# EAGLE design KENDALI POMPA TANK (EAGLE 7.4.0)
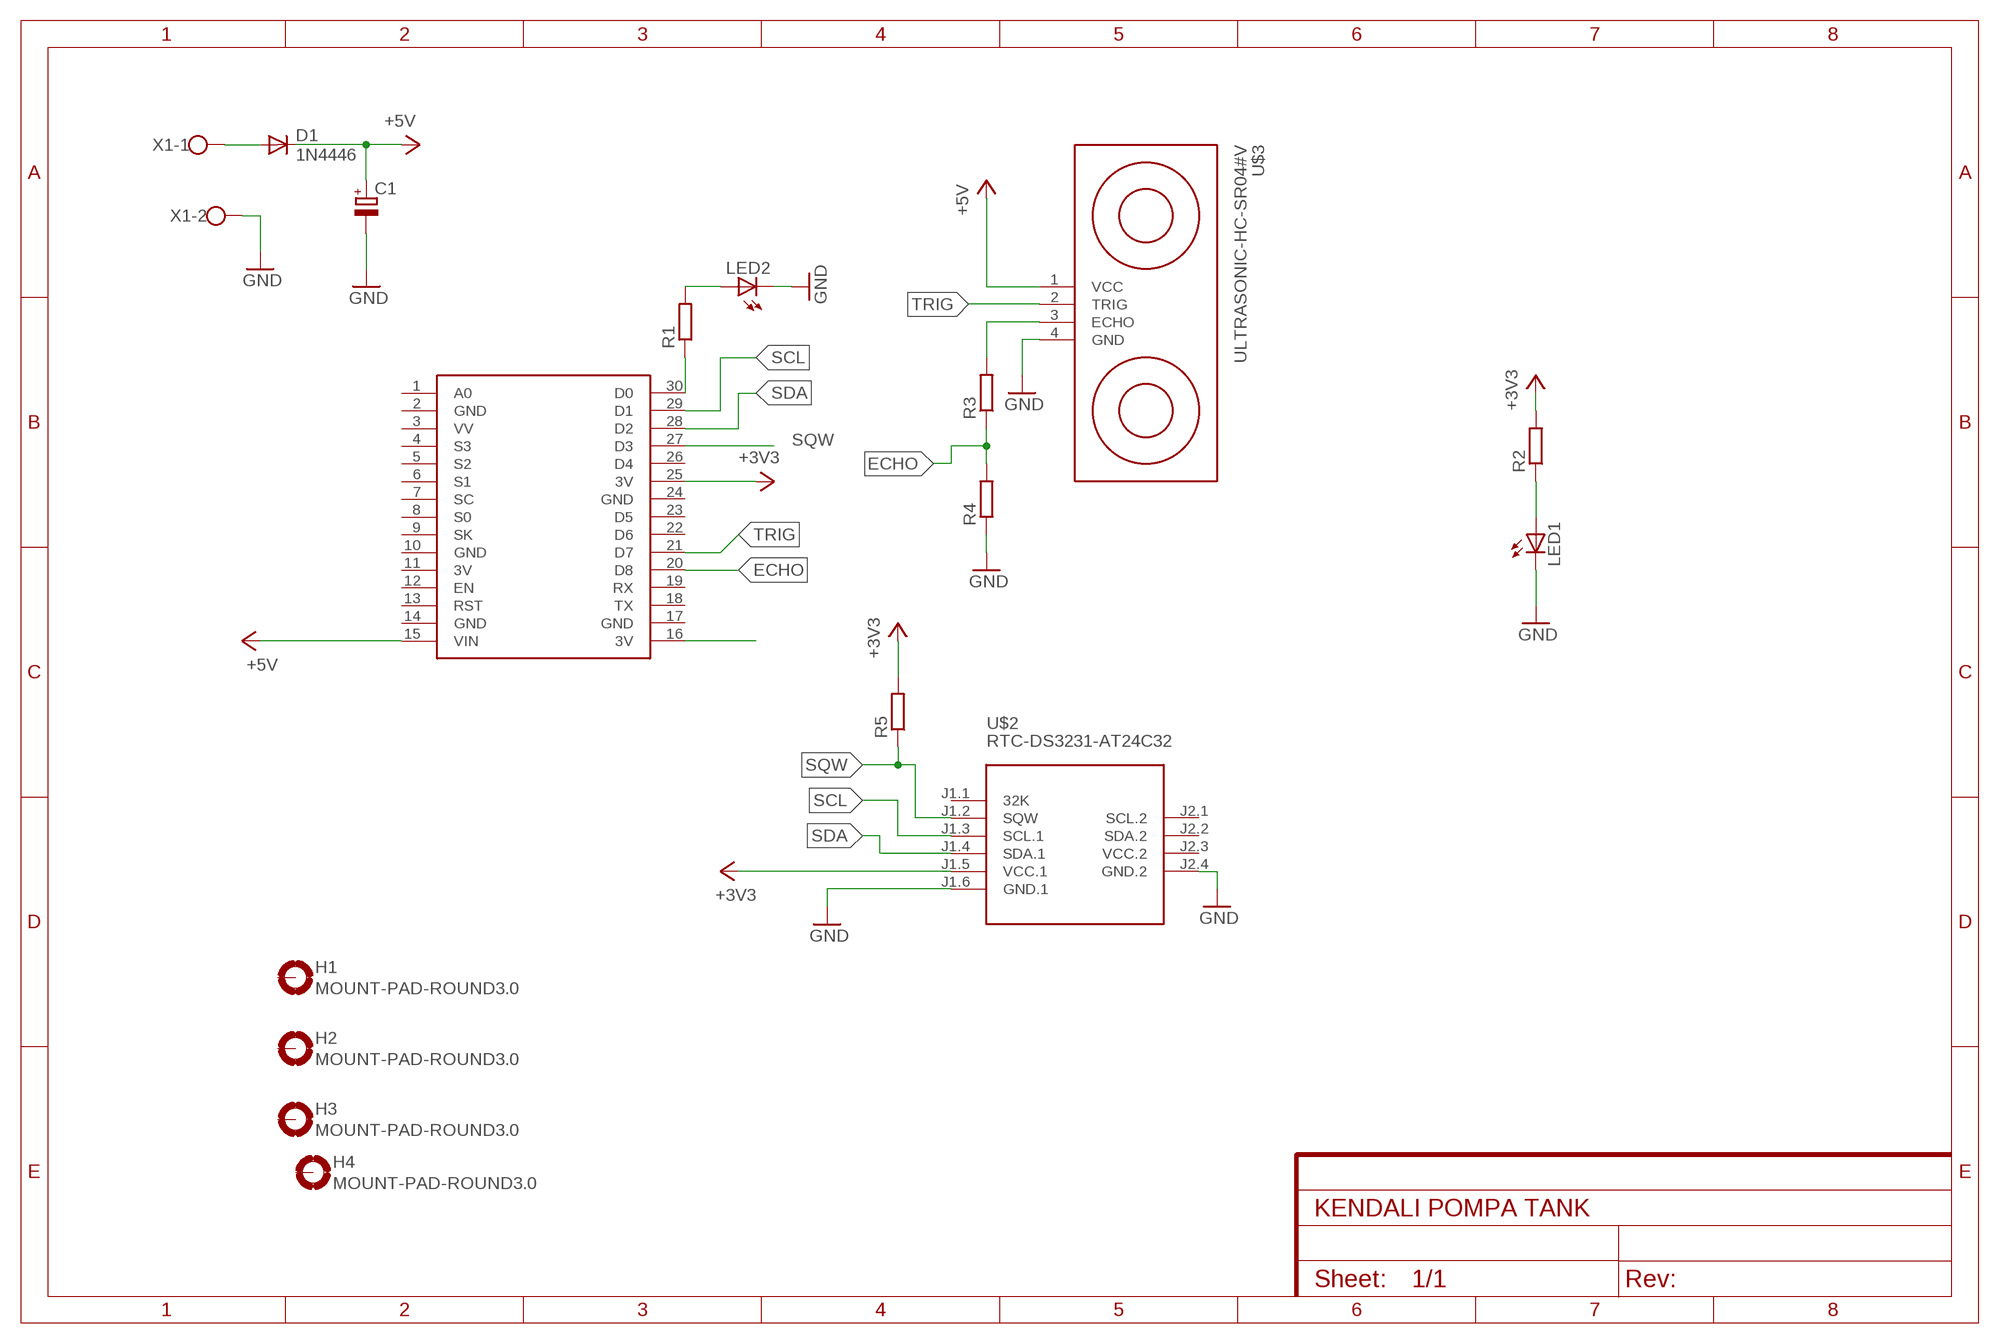
[diagram p0: schematic, sheet 1]

## Parts
C1  CPOL-EUE5-5  [E5-5]
D1  1N4446  [DO35-10]
H1  MOUNT-PAD-ROUND3.0  [3,0-PAD]
H2  MOUNT-PAD-ROUND3.0  [3,0-PAD]
H3  MOUNT-PAD-ROUND3.0  [3,0-PAD]
H4  MOUNT-PAD-ROUND3.0  [3,0-PAD]
LED1  LED5MM  [LED5MM]
LED2  LED5MM  [LED5MM]
R1  R-EU_0207/10  [0207/10]
R2  R-EU_0207/10  [0207/10]
R3  R-EU_0207/10  [0207/10]
R4  R-EU_0207/10  [0207/10]
R5  R-EU_0207/10  [0207/10]
U$1  NODEMCU  [NODEMCU]
U$2  RTC-DS3231-AT24C32  [RTC-DS3231-AT24C32]
U$3  ULTRASONIC-HC-SR04#V  [ULTRASONIC-HC-SR04#V]
X1  W237-102  [W237-102]

## Nets
+3V3: R2.2 R5.2 U$1.25(3V) U$2.J1.5(VCC.1)
+5V: C1.+ D1.C U$1.15(VIN) U$3.1(VCC)
ECHO: R3.1 R4.2 U$1.20(D8)
GND: C1.- LED1.K(C) LED2.K(C) R4.1 U$2.J1.6(GND.1) U$2.J2.4(GND.2) U$3.4(GND) X1.2
N$1: U$1.16(3V)
N$2: R1.1 U$1.30(D0)
N$3: LED2.A R1.2
N$4: LED1.A R2.1
N$5: D1.A X1.1
N$6: R3.2 U$3.3(ECHO)
SCL: U$1.29(D1) U$2.J1.3(SCL.1)
SDA: U$1.28(D2) U$2.J1.4(SDA.1)
SQW: R5.1 U$1.27(D3) U$2.J1.2(SQW)
TRIG: U$1.21(D7) U$3.2(TRIG)
Unconnected: H1.B3,0(MOUNT) H2.B3,0(MOUNT) H3.B3,0(MOUNT) H4.B3,0(MOUNT) U$1.1(A0) U$1.3(VV) U$1.4(S3) U$1.5(S2) U$1.6(S1) U$1.7(SC) U$1.8(S0) U$1.9(SK) U$1.12(EN) U$1.13(RST) U$1.18(TX) U$1.19(RX) U$1.22(D6) U$1.23(D5) U$1.26(D4) U$2.J1.1(32K) U$2.J2.1(SCL.2) U$2.J2.2(SDA.2)

## Power pins joined to a net without a drawn wire
3V: U$1.11(3V)
GND: U$1.2(GND) U$1.10(GND) U$1.14(GND) U$1.17(GND) U$1.24(GND)
VCC.2: U$2.J2.3(VCC.2)

## Library data of the parts
C1 = rcl:CPOL-EU: POLARIZED CAPACITOR, European symbol
D1 = diode:1N4446: DIODE high speed (Philips)
H1-H4 = holes:MOUNT-PAD-ROUND: MOUNTING PAD, round
LED1 LED2 = led:LED: LED OSRAM: - CHIPLED LG R971, LG N971, LY N971, LG Q971, LY Q971, LO R971, LY R971 LH N974, LH R974 LS Q976, LO Q976, LY Q976 LO Q996 - Hyper CHIPLED LW Q18S LB Q993, LB Q99A, LB R99A - SideLED LS A670, LO A670, LY A670, LG A670, LP A670 LB A673, LV A673, LT A673, LW A673 LH A674 LY A675 LS A676, LA A676, LO A676, LY A676, LW A676 LS A679, LY A679, LG A679 - Hyper Micro SIDELED® LS Y876, LA Y876, LO Y876, LY Y876 LT Y87S - SmartLED LW L88C, LW L88S LB L89C, LB L89S, LG L890 LS L89K, LO L89K, LY L89K LS L896, LA L896, LO L896, LY L896 - TOPLED LS T670, LO T670, LY T670, LG T670, LP T670 LSG T670, LSP T670, LSY T670, LOP T670, LYG T670 LG T671, LOG T671, LSG T671 LB T673, LV T673, LT T673, LW T673 LH T674 LS T676, LA T676, LO T676, LY T676, LB T676, LH T676, LSB T676, LW T676 LB T67C, LV T67C, LT T67C, LS T67K, LO T67K, LY T67K, LW E67C LS E67B, LA E67B, LO E67B, LY E67B, LB E67C, LV E67C, LT E67C LW T67C LS T679, LY T679, LG T679 LS T770, LO T770, LY T770, LG T770, LP T770 LB T773, LV T773, LT T773, LW T773 LH T774 LS E675, LA E675, LY E675, LS T675 LS T776, LA T776, LO T776, LY T776, LB T776 LHGB T686 LT T68C, LB T68C - Hyper Mini TOPLED® LB M676 - Mini TOPLED Santana® LG M470 LS M47K, LO M47K, LY M47K Source: http://www.osram.convergy.de LUXEON: - LUMILED® LXK2-PW12-R00, LXK2-PW12-S00, LXK2-PW14-U00, LXK2-PW14-V00 LXK2-PM12-R00, LXK2-PM12-S00, LXK2-PM14-U00 LXK2-PE12-Q00, LXK2-PE12-R00, LXK2-PE12-S00, LXK2-PE14-T00, LXK2-PE14-U00 LXK2-PB12-K00, LXK2-PB12-L00, LXK2-PB12-M00, LXK2-PB14-N00, LXK2-PB14-P00, LXK2-PB14-Q00 LXK2-PR12-L00, LXK2-PR12-M00, LXK2-PR14-Q00, LXK2-PR14-R00 LXK2-PD12-Q00, LXK2-PD12-R00, LXK2-PD12-S00 LXK2-PH12-R00, LXK2-PH12-S00 LXK2-PL12-P00, LXK2-PL12-Q00, LXK2-PL12-R00 Source: www.luxeon.com KINGBRIGHT: KA-3528ASYC Source: www.kingbright.com
R1-R5 = rcl:R-EU_: RESISTOR, European symbol
U$1 = nodemcu:NODEMCU
U$2 = diy-modules:RTC-DS3231-AT24C32: RTC Module with Battery and EEPROM based on DS3231 and AT24C32 chips Tutorial can be found here: https://edwardmallon.wordpress.com/2014/05/21/using-a-cheap-3-ds3231-rtc-at24c32-eeprom-from-ebay/ Click here to find device on ebay.com <http://www.ebay.com/sch/DS3231+AT24C32+module>
U$3 = diy-modules:ULTRASONIC-HC-SR04: Ultrasonic Ranging Module HC-SR04 More details available here: http://randomnerdtutorials.com/complete-guide-for-ultrasonic-sensor-hc-sr04/ Click here to find device on ebay.com <http://www.ebay.com/sch/hc+sr04+ultrasonic>
X1 = con-wago-500:W237-102: WAGO SCREW CLAMP; MPN: 237-102; OC_FARNELL: unknown; OC_NEWARK: 70K9898

## Board
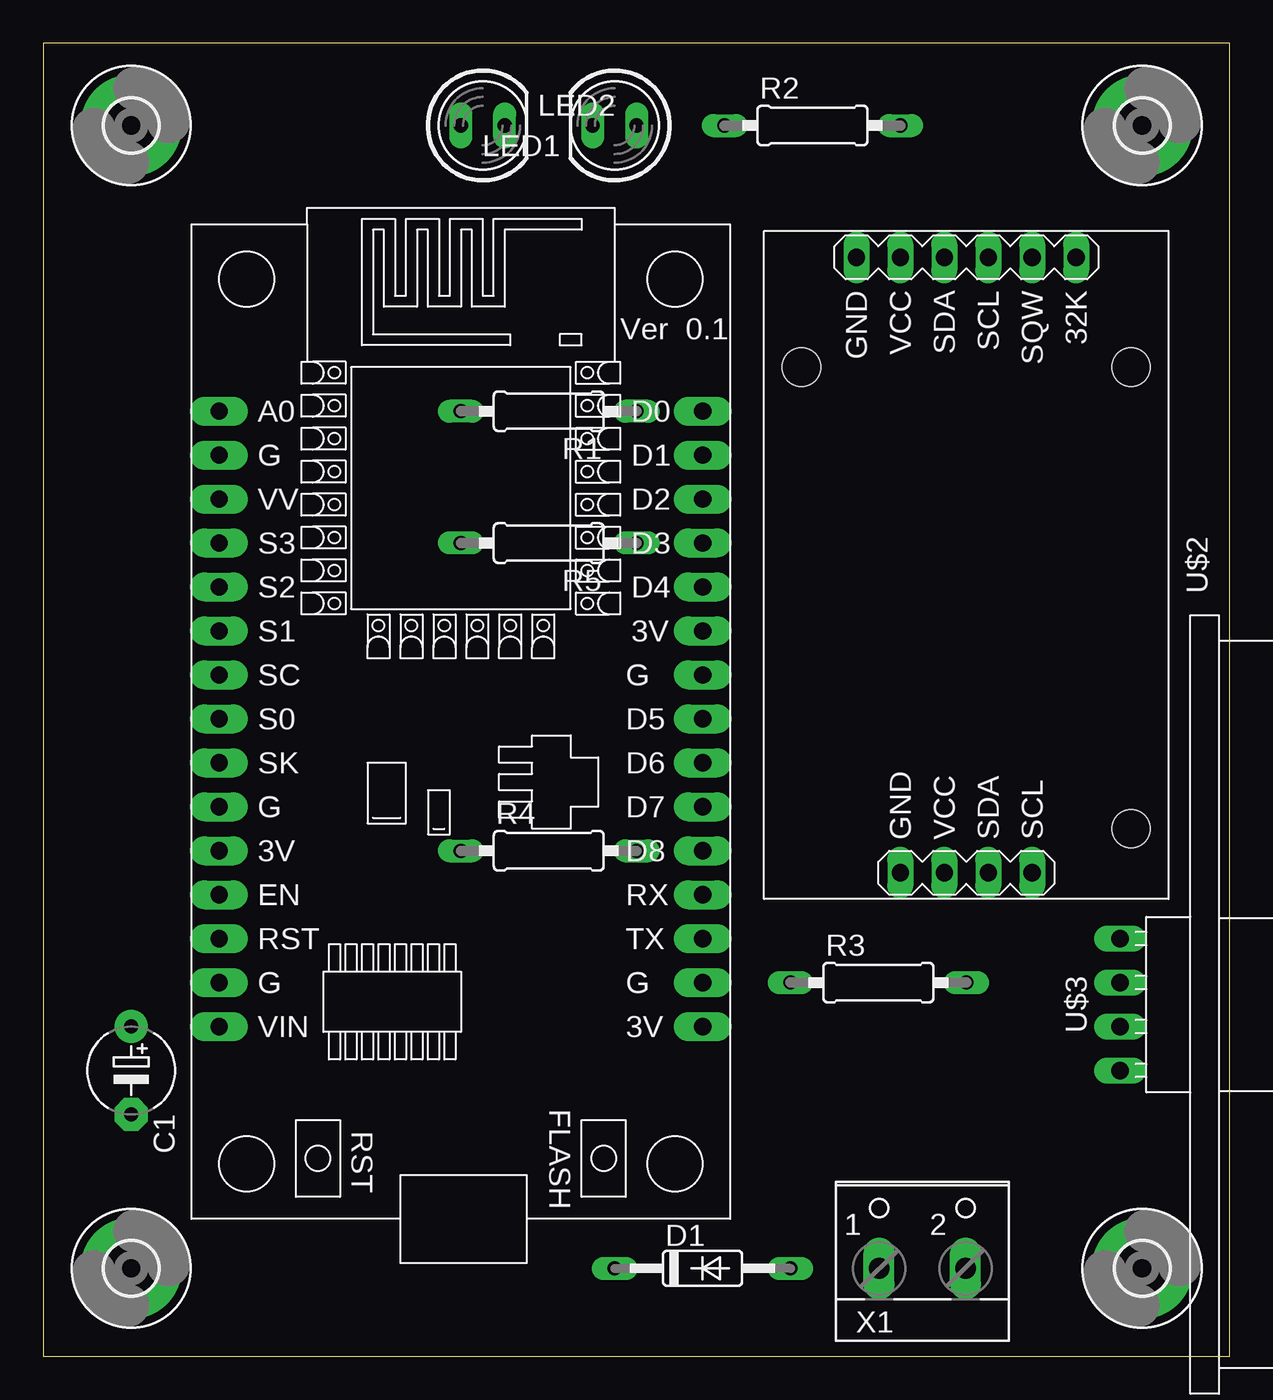
[diagram p1: board, top side]
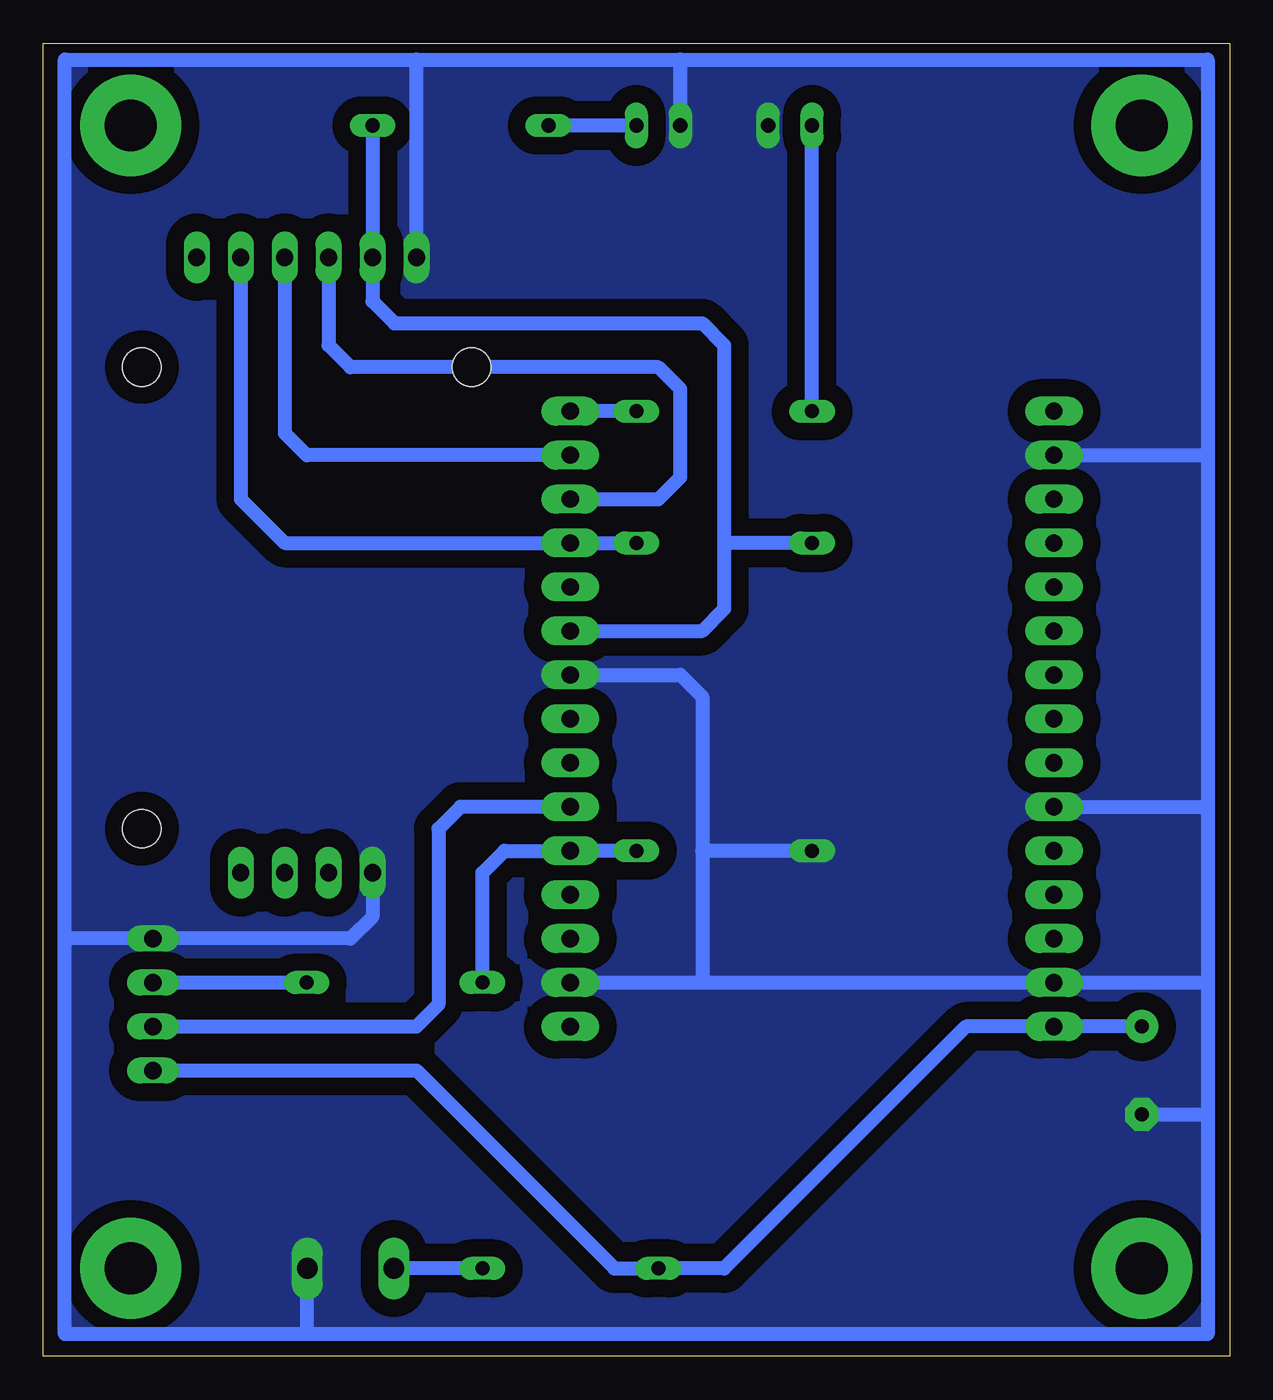
[diagram p2: board, bottom side, seen from below]

Size 68.56 x 75.87 mm. Coordinates in mm from the lower left corner, seen from the top.
Outline: 0,0 68.56,0 68.56,75.87 0,75.87 0,0
Copper layers (1*16): Top 0.035mm / dielectric 1.5mm / Bottom 0.035mm
Design rules "default": minimum track width 10mil, minimum drill 24mil, track to track 8mil, track to pad 8mil, pad to pad 8mil, via to via 8mil, smd to smd 8mil, copper to edge 40mil, drill to drill 8mil, minimum pad ring 10mil, minimum via ring 8mil, stop-mask expansion 4mil, vias tented up to drill 0mil, thermal gap 10mil

### Footprints (pad centres in the part's own frame; a part is rotated, then mirrored left to right if it is on the bottom)
E5-5 = drill 0.813 pad 1.905: + -2.54,0 | drill 0.813 pad 1.905 octagon: - 2.54,0
DO35-10 = drill 0.813 long: A 5.08,0; C -5.08,0
3,0-PAD = drill 3 pad 5.842: B3,0 0,0
LED5MM = drill 0.813 long: A -1.27,0; K 1.27,0
0207/10 = drill 0.813 long: 1 -5.08,0; 2 5.08,0
NODEMCU = drill 1 pad 1.676 long: 1 -13.97,17.78; 2 -13.97,15.24; 3 -13.97,12.7; 4 -13.97,10.16; 5 -13.97,7.62; 6 -13.97,5.08; 7 -13.97,2.54; 8 -13.97,0; 9 -13.97,-2.54; 10 -13.97,-5.08; 11 -13.97,-7.62; 12 -13.97,-10.16; 13 -13.97,-12.7; 14 -13.97,-15.24; 15 -13.97,-17.78; 16 13.97,-17.78; 17 13.97,-15.24; 18 13.97,-12.7; 19 13.97,-10.16; 20 13.97,-7.62; 21 13.97,-5.08; 22 13.97,-2.54; 23 13.97,0; 24 13.97,2.54; 25 13.97,5.08; 26 13.97,7.62; 27 13.97,10.16; 28 13.97,12.7; 29 13.97,15.24; 30 13.97,17.78
RTC-DS3231-AT24C32 = drill 1 long: J1.1 -17.78,6.35; J1.2 -17.78,3.81; J1.3 -17.78,1.27; J1.4 -17.78,-1.27; J1.5 -17.78,-3.81; J1.6 -17.78,-6.35; J2.1 17.78,3.81; J2.2 17.78,1.27; J2.3 17.78,-1.27; J2.4 17.78,-3.81 | hole 2.2: -11.43,-9.525; -11.43,9.525; 15.24,9.525
ULTRASONIC-HC-SR04#V = drill 1 long: 1 -3.81,0; 2 -1.27,0; 3 1.27,0; 4 3.81,0
W237-102 = drill 1.194 long: 1 -2.5,-1.27; 2 2.5,-1.27

### Placement (x,y rotation side)
C1  5.08,16.51 270 top
D1  38.1,5.08 0 top
H1  63.5,5.08 0 top
H2  5.08,71.12 0 top
H3  63.5,71.12 0 top
H4  5.08,5.08 0 top
LED1  33.02,71.12 180 top
LED2  25.4,71.12 0 top
R1  29.21,54.61 180 top
R2  44.45,71.12 0 top
R3  48.26,21.59 0 top
R4  29.21,29.21 0 top
R5  29.21,46.99 180 top
U$1  24.13,36.83 0 top
U$2  53.34,45.72 270 top
U$3  62.23,20.32 90 top
X1  50.8,6.35 0 top

### Tracks (layer width: path | path; a pad name or v marks a point on that pad's centre or on a via)
+3V3
  Bottom 0.813: 29.21,46.99 29.21,58.42 30.48,59.69 48.26,59.69 49.53,60.96 U$2.J1.5 R2.2 | 29.21,46.99 29.21,43.18 30.48,41.91 U$1.25 | R5.2 29.21,46.99
+5V
  Bottom 0.813: C1.+ U$1.15 15.24,19.05 29.21,5.08 D1.C 35.56,5.08 46.99,16.51 U$3.1
ECHO
  Bottom 0.813: R3.1 43.18,27.94 41.91,29.21 U$1.20 R4.2
GND
  Bottom 0.813: U$2.J1.6 46.99,74.93 | 46.99,74.93 31.75,74.93 | 31.75,74.93 1.27,74.93 1.27,52.07 | 1.27,52.07 1.27,31.75 | 1.27,31.75 1.27,21.59 | 1.27,21.59 1.27,13.97 | 1.27,13.97 1.27,1.27 53.34,1.27 | 53.34,1.27 67.31,1.27 67.31,24.13 | 67.31,24.13 67.31,74.93 46.99,74.93 | 1.27,21.59 U$1.14 30.48,21.59 | U$1.2 1.27,52.07 | U$1.10 1.27,31.75 | U$2.J2.4 49.53,25.4 50.8,24.13 U$3.4 67.31,24.13 | U$1.24 31.75,39.37 30.48,38.1 30.48,29.21 | 30.48,29.21 30.48,21.59 | 53.34,1.27 53.34,3.81 53.3,3.85 X1.2 | U$1.17 30.48,21.59 | LED1.K 31.75,74.93 | C1.- 1.27,13.97 | R4.1 30.48,29.21
  pour Bottom (isolate 1.016, no thermals): 68.58,0 68.58,76.2 0,76.2 0,0
N$2
  Bottom 0.813: R1.1 U$1.30
N$3
  Bottom 0.813: R1.2 LED2.A
N$4
  Bottom 0.813: LED1.A R2.1
N$5
  Bottom 0.813: D1.A X1.1
N$6
  Bottom 0.813: U$3.3 R3.2
SCL
  Bottom 0.813: U$2.J1.3 54.61,53.34 53.34,52.07 U$1.29
SDA
  Bottom 0.813: U$2.J1.4 52.07,58.42 50.8,57.15 33.02,57.15 31.75,55.88 31.75,50.8 33.02,49.53 U$1.28
SQW
  Bottom 0.813: U$2.J1.2 57.15,49.53 54.61,46.99 U$1.27 R5.1
TRIG
  Bottom 0.813: U$1.21 44.45,31.75 45.72,30.48 45.72,20.32 46.99,19.05 U$3.2